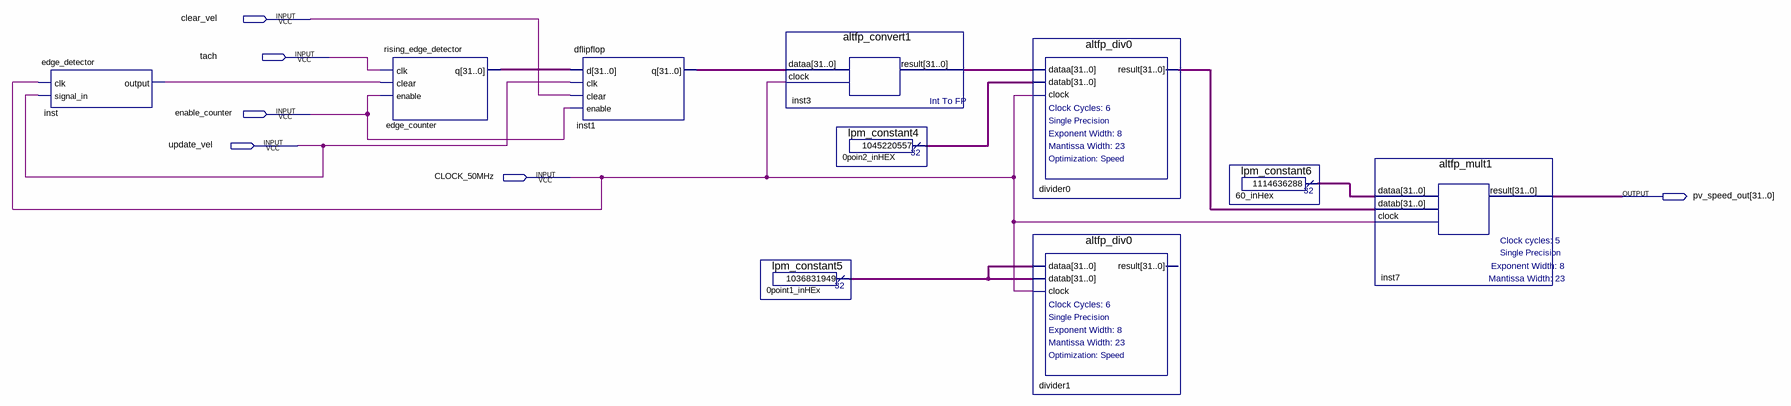
[diagram p0: schematic sheet]
// Quartus schematic velocityCalculator.bdf as structural Verilog: 10 symbols, 6 pins
module velocityCalculator (
  input  clear_vel,
  input  tach,
  input  enable_counter,
  input  update_vel,
  input  CLOCK_50MHz,
  output [31:0] pv_speed_out
);

  wire inst_output;
  wire [31:0] divider0_result, edge_counter_q, inst1_q, inst3_result, n0poin2_inHEX_result,
       n0point1_inHEx_result, n60_inHex_result;

  edge_detector inst (.clk(CLOCK_50MHz), .signal_in(update_vel), .\output (inst_output));
  rising_edge_detector edge_counter (.clk(tach), .clear(inst_output), .enable(enable_counter), .q(edge_counter_q));
  dflipflop inst1 (.d(edge_counter_q), .clk(update_vel), .clear(clear_vel), .enable(enable_counter), .q(inst1_q));
  lpm_constant5 u_0point1_inHEx (.result(n0point1_inHEx_result));
  altfp_convert1 inst3 (.dataa(inst1_q), .clock(CLOCK_50MHz), .result(inst3_result));
  lpm_constant4 u_0poin2_inHEX (.result(n0poin2_inHEX_result));
  altfp_div0 divider0 (
    .dataa(inst3_result), .datab(n0poin2_inHEX_result), .clock(CLOCK_50MHz), .result(divider0_result));
  altfp_div0 divider1 (
    .dataa(n0point1_inHEx_result), .datab(n0point1_inHEx_result), .clock(CLOCK_50MHz));  // open: result
  lpm_constant6 u_60_inHex (.result(n60_inHex_result));
  altfp_mult1 inst7 (.dataa(n60_inHex_result), .datab(divider0_result), .clock(CLOCK_50MHz), .result(pv_speed_out));
endmodule
